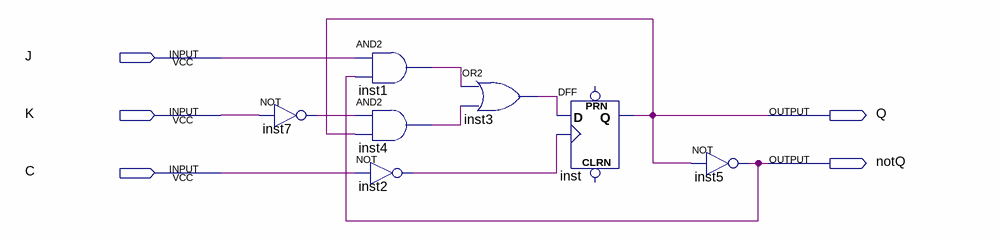
[diagram p0: schematic sheet]
// Quartus schematic Dynamic_JK.bdf as structural Verilog: 7 symbols, 5 pins
module Dynamic_JK (
  input  J,
  input  K,
  input  C,
  output Q,
  output notQ
);

  wire inst1_out, inst2_out, inst3_out, inst4_out, inst7_out;

  not inst7 (inst7_out, K);
  and inst1 (inst1_out, J, notQ);
  and inst4 (inst4_out, inst7_out, Q);
  not inst2 (inst2_out, C);
  or inst3 (inst3_out, inst1_out, inst4_out);
  DFF inst (.CLK(inst2_out), .D(inst3_out), .Q(Q));  // open: CLRN, PRN
  not inst5 (notQ, Q);
endmodule
